# EAGLE design IR Cape (EAGLE 6.4)
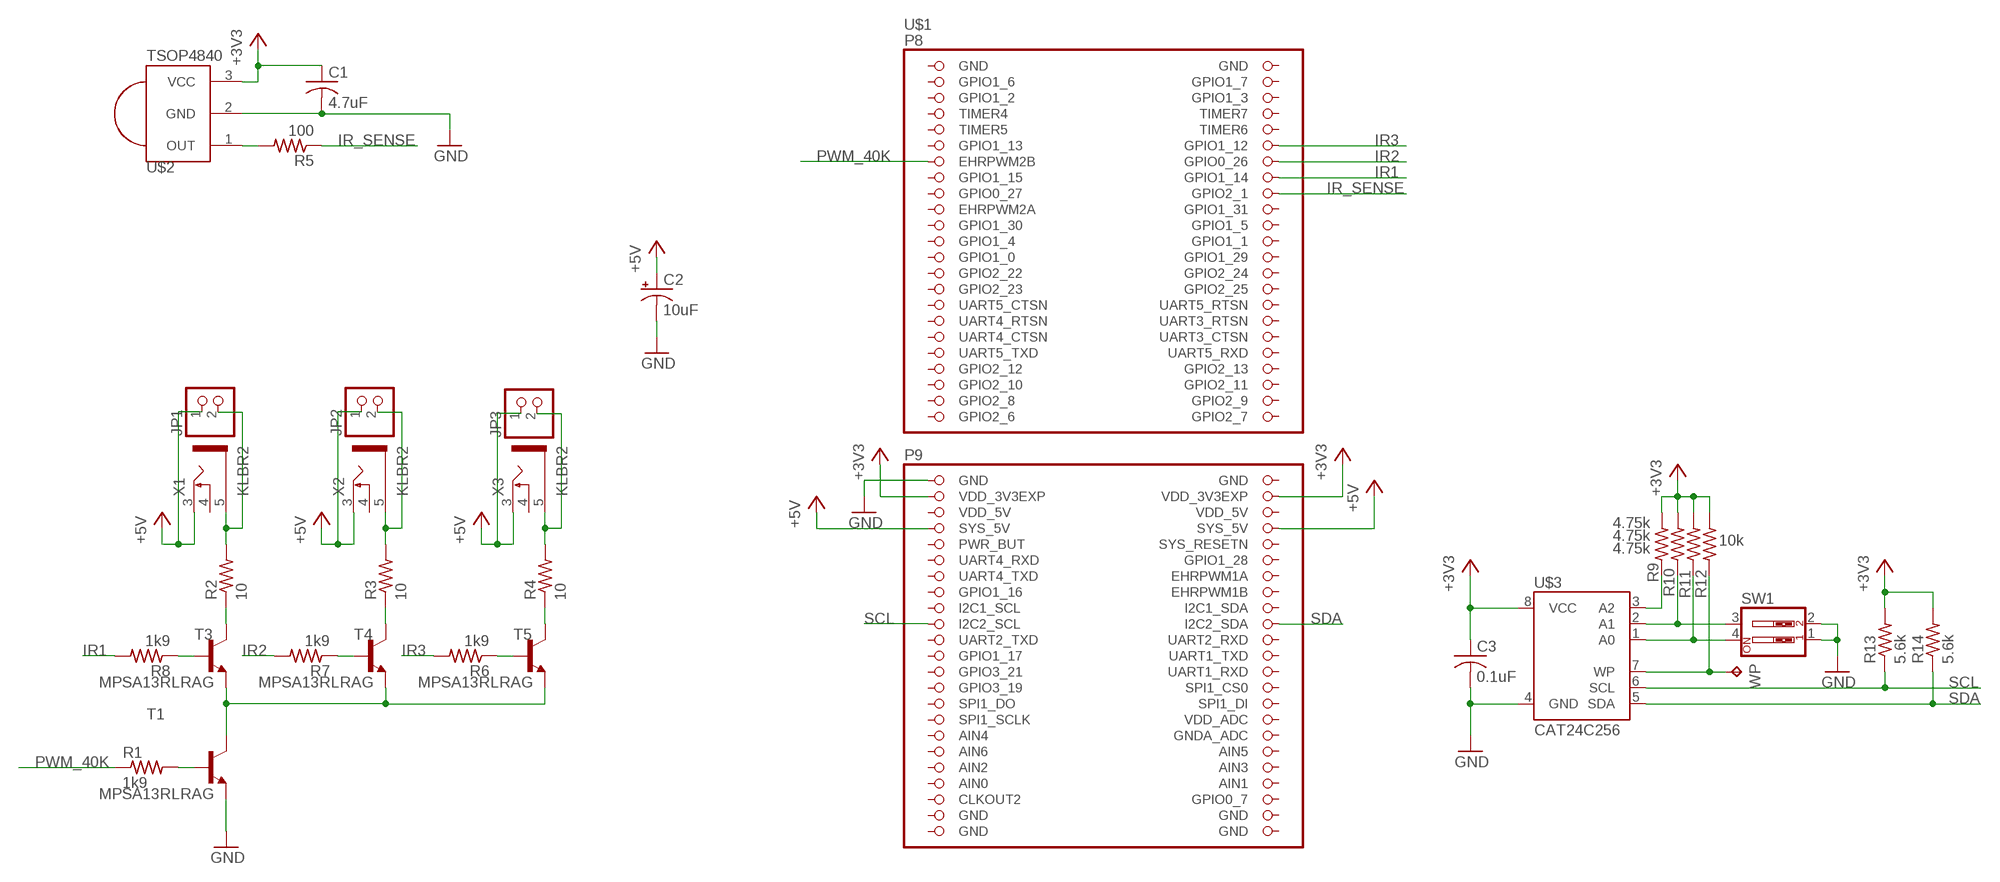
[diagram p0: schematic, sheet 1]

## Parts
C1  4.7uF  C-US025-024X044  [C025-024X044]
C2  10uF  CPOL-USE2-5  [E2-5]
C3  0.1uF  C-US025-024X044  [C025-024X044]
JP1  PINHD-1X2  [1X02]
JP2  PINHD-1X2  [1X02]
JP3  PINHD-1X2  [1X02]
R1  1k9  R-US_0207/10  [0207/10]
R2  10  R-US_0207/10  [0207/10]
R3  10  R-US_0207/10  [0207/10]
R4  10  R-US_0207/10  [0207/10]
R5  100  R-US_0207/10  [0207/10]
R6  1k9  R-US_0207/10  [0207/10]
R7  1k9  R-US_0207/10  [0207/10]
R8  1k9  R-US_0207/10  [0207/10]
R9  4.75k  R-US_0207/10  [0207/10]
R10  4.75k  R-US_0207/10  [0207/10]
R11  4.75k  R-US_0207/10  [0207/10]
R12  10k  R-US_0207/10  [0207/10]
R13  5.6k  R-US_0207/10  [0207/10]
R14  5.6k  R-US_0207/10  [0207/10]
SW1  SW_DIP-2  [EDG-02]
T1  MPSA13RLRAG  2N2222-NPN-TO92-EBC  [TO92-EBC]
T3  MPSA13RLRAG  2N2222-NPN-TO92-EBC  [TO92-EBC]
T4  MPSA13RLRAG  2N2222-NPN-TO92-EBC  [TO92-EBC]
T5  MPSA13RLRAG  2N2222-NPN-TO92-EBC  [TO92-EBC]
U$1  BEAGLEBONE_OUTLINE  [BEAGLEBONE_SHIELD]
U$2  TSOP4840  PNA460XM  [PNA460XM]
U$3  CAT24C256  [CAT24C256]
WP  TPB1,27  [B1,27]
X1  KLBR2  [KLBR2]
X2  KLBR2  [KLBR2]
X3  KLBR2  [KLBR2]

## Nets
+3V3: C1.1 C3.1 R9.2 R10.2 R11.2 R12.1 R13.2 R14.2 U$1.49(VDD_3V3EXP) U$1.50(VDD_3V3EXP) U$2.3(VCC) U$3.8(VCC)
+5V: C2.+ JP1.1 JP2.1 JP3.1 U$1.53(SYS_5V) U$1.54(SYS_5V) X1.3 X2.3 X3.3
GND: C1.2 C2.- C3.2 SW1.1 SW1.2 T1.E U$1.47(GND) U$2.2(GND) U$3.4(GND)
IR1: R8.2 U$1.16(GPIO1_14)
IR2: R7.2 U$1.14(GPIO0_26)
IR3: R6.2 U$1.12(GPIO1_12)
IR_SENSE: R5.1 U$1.18(GPIO2_1)
N$1: JP1.2 R2.2 X1.5
N$2: T1.C T3.E T4.E T5.E
N$3: R1.2 T1.B
N$4: R4.1 T5.C
N$5: JP3.2 R4.2 X3.5
N$6: R3.1 T4.C
N$7: R2.1 T3.C
N$9: JP2.2 R3.2 X2.5
N$10: R5.2 U$2.1(OUT)
N$11: R11.1 SW1.4 U$3.1(A0)
N$12: R8.1 T3.B
N$13: R7.1 T4.B
N$14: R6.1 T5.B
N$15: R10.1 SW1.3 U$3.2(A1)
N$16: R12.2 U$3.7(WP) WP.TP
N$17: R9.1 U$3.3(A2)
PWM_40K: R1.1 U$1.13(EHRPWM2B)
SCL: R13.1 U$1.65(I2C2_SCL) U$3.6(SCL)
SDA: R14.1 U$1.66(I2C2_SDA) U$3.5(SDA)
Unconnected: U$1.3(GPIO1_6) U$1.4(GPIO1_7) U$1.5(GPIO1_2) U$1.6(GPIO1_3) U$1.7(TIMER4) U$1.8(TIMER7) U$1.9(TIMER5) U$1.10(TIMER6) U$1.11(GPIO1_13) U$1.15(GPIO1_15) U$1.17(GPIO0_27) U$1.19(EHRPWM2A) U$1.20(GPIO1_31) U$1.21(GPIO1_30) U$1.22(GPIO1_5) U$1.23(GPIO1_4) U$1.24(GPIO1_1) U$1.25(GPIO1_0) U$1.26(GPIO1_29) U$1.27(GPIO2_22) U$1.28(GPIO2_24) U$1.29(GPIO2_23) U$1.30(GPIO2_25) U$1.31(UART5_CTSN) U$1.32(UART5_RTSN) U$1.33(UART4_RTSN) U$1.34(UART3_RTSN) U$1.35(UART4_CTSN) U$1.36(UART3_CTSN) U$1.37(UART5_TXD) U$1.38(UART5_RXD) U$1.39(GPIO2_12) U$1.40(GPIO2_13) U$1.41(GPIO2_10) U$1.42(GPIO2_11) U$1.43(GPIO2_8) U$1.44(GPIO2_9) U$1.45(GPIO2_6) U$1.46(GPIO2_7) U$1.55(PWR_BUT) U$1.56(SYS_RESETN) U$1.57(UART4_RXD) U$1.58(GPIO1_28) U$1.59(UART4_TXD) U$1.60(EHRPWM1A) U$1.61(GPIO1_16) U$1.62(EHRPWM1B) U$1.63(I2C1_SCL) U$1.64(I2C1_SDA) U$1.67(UART2_TXD) U$1.68(UART2_RXD) U$1.69(GPIO1_17) U$1.70(UART1_TXD) U$1.71(GPIO3_21) U$1.72(UART1_RXD) U$1.73(GPIO3_19) U$1.74(SPI1_CS0) U$1.75(SPI1_DO) U$1.76(SPI1_DI) U$1.77(SPI1_SCLK) U$1.78(VDD_ADC) U$1.79(AIN4) U$1.80(GNDA_ADC) U$1.81(AIN6) U$1.82(AIN5) U$1.83(AIN2) U$1.84(AIN3) U$1.86(AIN1) U$1.87(CLKOUT2) U$1.88(GPIO0_7) X1.4 X2.4 X3.4

## Power pins joined to a net without a drawn wire
AIN0: U$1.85(AIN0)
GND: U$1.1(GND) U$1.2(GND) U$1.48(GND) U$1.89(GND) U$1.90(GND) U$1.91(GND) U$1.92(GND)
VDD_5V: U$1.51(VDD_5V) U$1.52(VDD_5V)

## Library data of the parts
C1 C3 = rcl:C-US: CAPACITOR, American symbol
C2 = adafruit:CPOL-US: POLARIZED CAPACITOR, American symbol
JP1-JP3 = pinhead:PINHD-1X2: PIN HEADER
R1-R14 = resistor:R-US_: RESISTOR, American symbol
SW1 = special:SW_DIP-2: DIP SWITCH
T1 T3-T5 = transistor-neu-to92:*-NPN-: NPN Transistror
U$1 = adafruit:BEAGLEBONE_OUTLINE: Should match A3 pinout - but not completely tested
U$2 = adafruit:PNA460XM: IR 38KHz receiver PNA4602 and related receivers http://www.ladyada.net/library/pcb/eaglelibrary.html
U$3 = ON Semiconductor EEPROM:CAT24C256
WP = testpad:TP: Test pad
X1-X3 = con-lumberg:KLBR?: Jack connectors according to JISC 6560, 2.5mm / 3.5 mm Klinkensteckverbinder nach JISC 6560, 2.5mm / 3,5 mm Source: http://www.lumberg.com/Produkte/PDFs/KLBR2.pdf www.lumberg.com/Produkte/PDFs/KLBR1.pdf; OC_FARNELL: unknown; OC_NEWARK: unknown

## Board
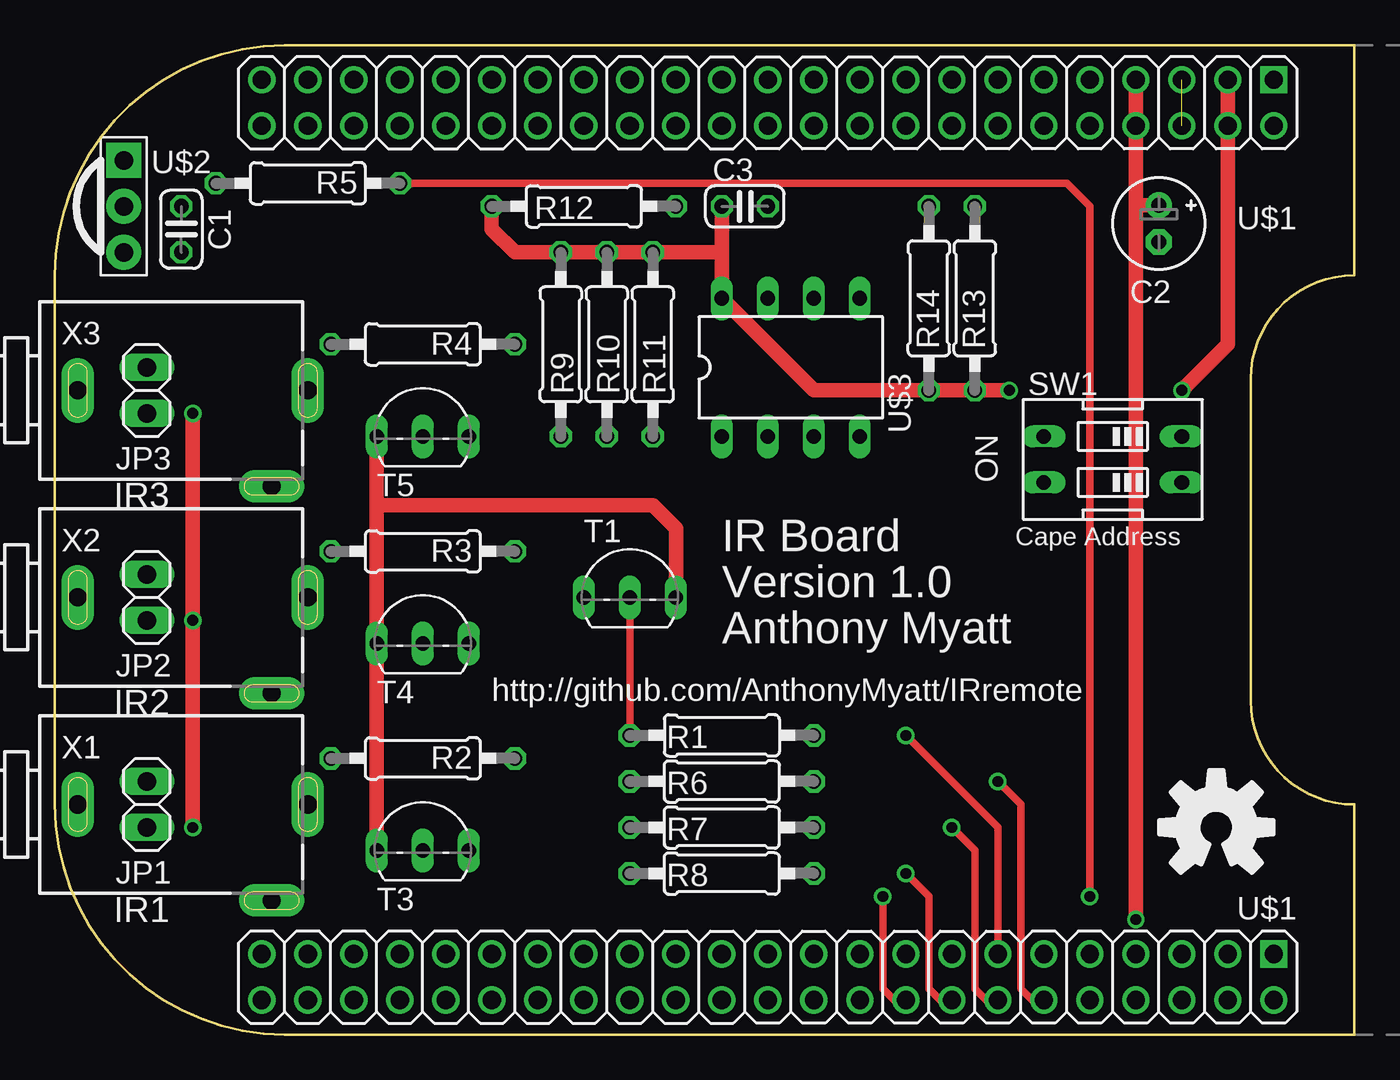
[diagram p1: board, top side]
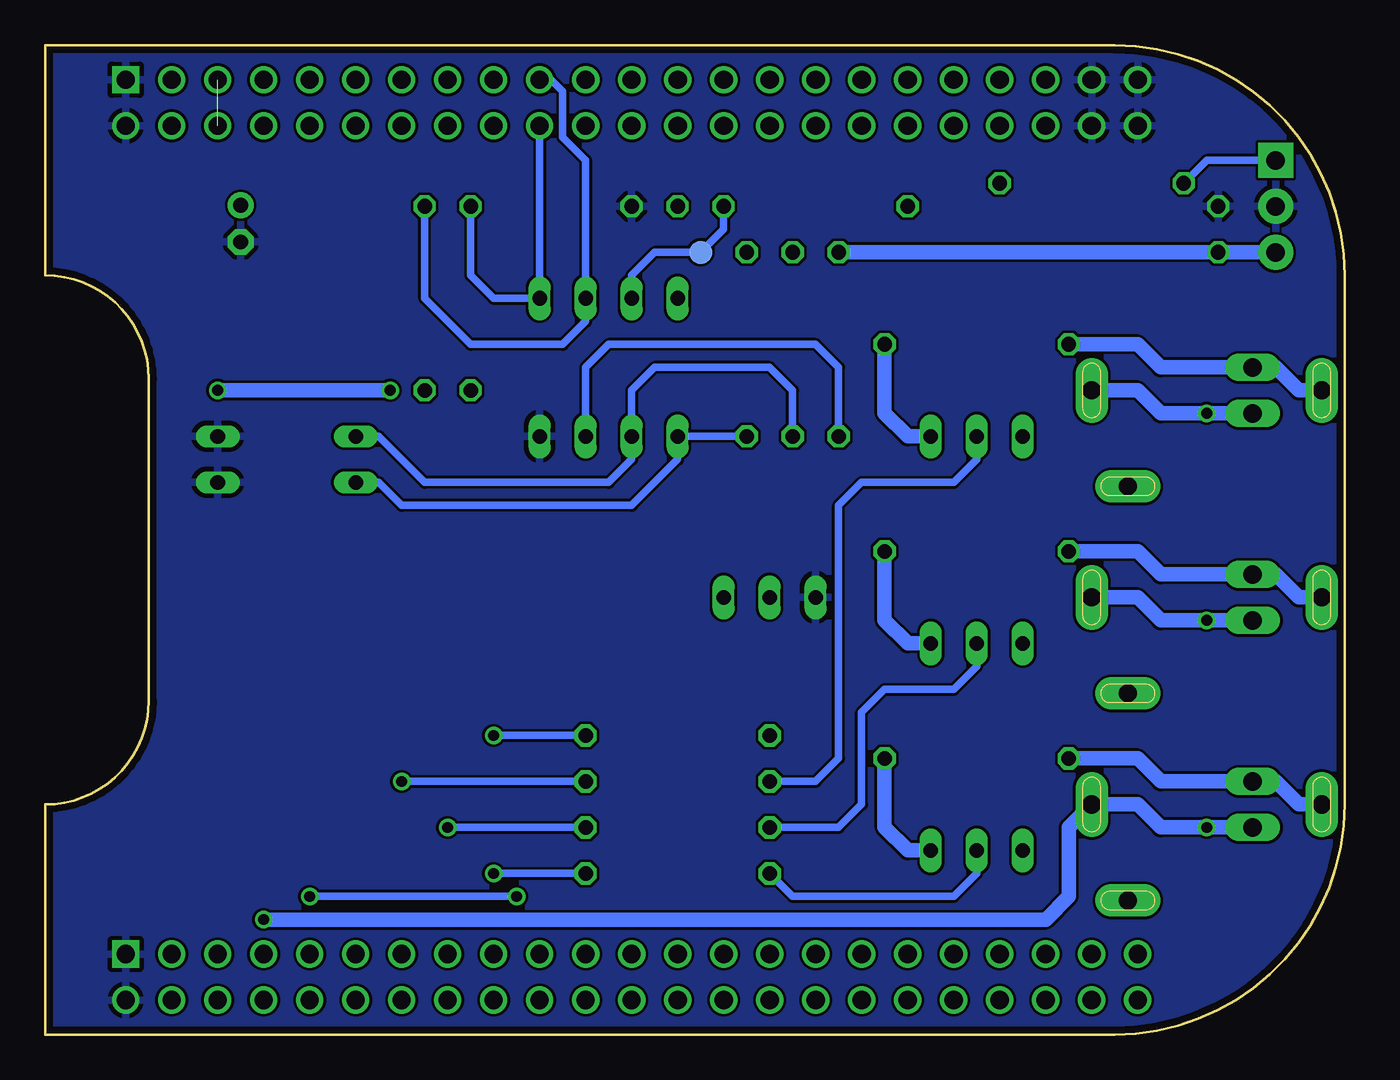
[diagram p2: board, bottom side, seen from below]

Size 71.75 x 54.61 mm. Coordinates in mm from the lower left corner, seen from the top.
Copper layers (1*16): Top 0.0356mm / dielectric 1.5011mm / Bottom 0.0356mm
Design rules "OSHPark *": minimum track width 6mil, minimum drill 13mil, track to track 6mil, track to pad 6mil, pad to pad 6mil, via to via 6mil, smd to smd 6mil, copper to edge 15mil, drill to drill 6mil, minimum pad ring 7mil, minimum via ring 7mil, stop-mask expansion 4mil, vias tented up to drill 200mil, thermal gap 10mil

### Footprints (pad centres in the part's own frame; a part is rotated, then mirrored left to right if it is on the bottom)
C025-024X044 = drill 0.813 octagon: 1 -1.27,0; 2 1.27,0
E2-5 = drill 0.813 pad 1.422: + -1.016,0 | drill 0.813 pad 1.422 octagon: - 1.016,0
1X02 = drill 1.016 long: 1 -1.27,0; 2 1.27,0
0207/10 = drill 0.813 octagon: 1 -5.08,0; 2 5.08,0
EDG-02 = drill 0.813 long: 1 -1.27,-3.81; 2 1.27,-3.81; 3 1.27,3.81; 4 -1.27,3.81
TO92-EBC = drill 0.813 long: B 0,-1.27; C 2.54,-1.27; E -2.54,-1.27
BEAGLEBONE_SHIELD = drill 1 square: 1 4.445,19.05; 47 52.705,19.05 | drill 1: 2 1.905,19.05; 3 4.445,21.59; 4 1.905,21.59; 5 4.445,24.13; 6 1.905,24.13; 7 4.445,26.67; 8 1.905,26.67; 9 4.445,29.21; 10 1.905,29.21; 11 4.445,31.75; 12 1.905,31.75; 13 4.445,34.29; 14 1.905,34.29; 15 4.445,36.83; 16 1.905,36.83; 17 4.445,39.37; 18 1.905,39.37; 19 4.445,41.91; 20 1.905,41.91; 21 4.445,44.45; 22 1.905,44.45; 23 4.445,46.99; 24 1.905,46.99; 25 4.445,49.53; 26 1.905,49.53; 27 4.445,52.07; 28 1.905,52.07; 29 4.445,54.61; 30 1.905,54.61; 31 4.445,57.15; 32 1.905,57.15; 33 4.445,59.69; 34 1.905,59.69; 35 4.445,62.23; 36 1.905,62.23; 37 4.445,64.77; 38 1.905,64.77; 39 4.445,67.31; 40 1.905,67.31; 41 4.445,69.85; 42 1.905,69.85; 43 4.445,72.39; 44 1.905,72.39; 45 4.445,74.93; 46 1.905,74.93; 48 50.165,19.05; 49 52.705,21.59; 50 50.165,21.59; 51 52.705,24.13; 52 50.165,24.13; 53 52.705,26.67; 54 50.165,26.67; 55 52.705,29.21; 56 50.165,29.21; 57 52.705,31.75; 58 50.165,31.75; 59 52.705,34.29; 60 50.165,34.29; 61 52.705,36.83; 62 50.165,36.83; 63 52.705,39.37; 64 50.165,39.37; 65 52.705,41.91; 66 50.165,41.91; 67 52.705,44.45; 68 50.165,44.45; 69 52.705,46.99; 70 50.165,46.99; 71 52.705,49.53; 72 50.165,49.53; 73 52.705,52.07; 74 50.165,52.07; 75 52.705,54.61; 76 50.165,54.61; 77 52.705,57.15; 78 50.165,57.15; 79 52.705,59.69; 80 50.165,59.69; 81 52.705,62.23; 82 50.165,62.23; 83 52.705,64.77; 84 50.165,64.77; 85 52.705,67.31; 86 50.165,67.31; 87 52.705,69.85; 88 50.165,69.85; 89 52.705,72.39; 90 50.165,72.39; 91 52.705,74.93; 92 50.165,74.93
PNA460XM = drill 1.016 pad 1.93 square: 1 -2.54,0 | drill 1.016 pad 1.93: 2 0,0; 3 2.54,0
CAT24C256 = drill 0.813 long: 1 -3.81,-3.81; 2 -1.27,-3.81; 3 1.27,-3.81; 4 3.81,-3.81; 5 3.81,3.81; 6 1.27,3.81; 7 -1.27,3.81; 8 -3.81,3.81
B1,27 = smd 1.27 x 1.27: TP 0,0
KLBR2 = drill 1 pad 1.8 long: 3 0,-6.35; 4 -5.3,-4.35; 5 0,6.35

### Placement (x,y rotation side)
C1  6.99,44.45 90 top
C2  60.96,44.77 270 top
C3  38.1,45.72 0 top
JP1  5.08,12.7 90 top
JP2  5.08,24.13 90 top
JP3  5.08,35.56 90 top
R1  36.83,16.51 180 top
R2  20.32,15.24 180 top
R3  20.32,26.67 180 top
R4  20.32,38.1 180 top
R5  13.97,46.99 180 top
R6  36.83,13.97 0 top
R7  36.83,11.43 0 top
R8  36.83,8.89 0 top
R9  27.94,38.1 90 top
R10  30.48,38.1 90 top
R11  33.02,38.1 90 top
R12  29.21,45.72 0 top
R13  50.8,40.64 270 top
R14  48.26,40.64 270 top
SW1  58.42,31.75 90 top
T1  31.75,25.4 0 top
T3  20.32,11.43 0 top
T4  20.32,22.86 0 top
T5  20.32,34.29 0 top
U$1  86.36,0 90 top
U$2  3.81,45.72 270 top
U$3  40.64,36.83 0 top
WP  35.56,43.18 0 bottom
X1  7.62,12.7 90 top
X2  7.62,24.13 90 top
X3  7.62,35.56 90 top

### Tracks (layer width: path | path; a pad name or v marks a point on that pad's centre or on a via)
+3V3  (via drill 0.6)
  Top 0.813: 36.83,43.18 U$3.8 41.91,35.56 R14.2 R13.2 v52.7,35.56 | 36.83,43.18 C3.1 | 36.83,43.18 R11.2 R10.2 R9.2 25.4,43.18 24.13,44.45 R12.1 | U$1.49 U$1.50 64.77,38.1 v62.23,35.56
  Bottom 0.813: U$2.3 C1.1 R9.2 | v62.23,35.56 v52.7,35.56
+5V  (via drill 0.6)
  Top 0.61: U$1.54 59.69,45.78
  Top 0.813: U$1.53 U$1.54 v59.69,6.35 | v7.62,11.43 v7.62,22.86 v7.62,34.29 | 59.69,45.78 C2.+
  Bottom 0.813: JP1.1 v7.62,11.43 10.16,11.43 11.43,12.7 X1.3 15.24,11.43 15.24,7.62 16.51,6.35 v59.69,6.35 | JP2.1 v7.62,22.86 10.16,22.86 11.43,24.13 X2.3 | JP3.1 v7.62,34.29 10.16,34.29 11.43,35.56 X3.3
GND
  pour Bottom: 73.66,55.88 -1.27,55.88 -1.27,-1.27 73.66,-1.27
IR1  (via drill 0.6)
  Top 0.406: U$1.16 48.9,1.91 48.26,2.54 48.26,7.62 v46.99,8.89
  Bottom 0.406: v46.99,8.89 R8.2
IR2  (via drill 0.6)
  Top 0.406: U$1.14 51.44,1.91 50.8,2.54 50.8,10.16 v49.53,11.43
  Bottom 0.406: v49.53,11.43 R7.2
IR3  (via drill 0.6)
  Top 0.406: U$1.12 53.98,1.91 53.34,2.54 53.34,12.7 v52.07,13.97
  Bottom 0.406: v52.07,13.97 R6.2
IR_SENSE  (via drill 0.6)
  Top 0.406: U$1.18 46.35,1.91 45.72,2.54 v45.72,7.62 | v57.15,7.62 57.15,45.72 55.88,46.99 R5.1
  Bottom 0.406: v45.72,7.62 v57.15,7.62
N$1
  Bottom 0.813: X1.5 2.54,12.7 3.81,13.97 JP1.2 10.16,13.97 11.43,15.24 R2.2
N$2
  Top 0.813: T5.E 17.78,29.21 | 17.78,29.21 T4.E T3.E | T1.C 34.29,27.94 33.02,29.21 17.78,29.21
N$3
  Top 0.406: R1.2 T1.B
N$4
  Bottom 0.813: T5.C 24.13,33.02 25.4,34.29 R4.1
N$5
  Bottom 0.61: 3.81,36.83 JP3.2
  Bottom 0.813: X3.5 2.54,35.56 3.81,36.83 | JP3.2 10.16,36.83 11.43,38.1 R4.2
N$6
  Bottom 0.813: T4.C 24.13,21.59 25.4,22.86 R3.1
N$7
  Bottom 0.813: T3.C 24.13,10.16 25.4,11.43 R2.1
N$8
  Top 0.254: 64.97,9.41 arc10 65.29,9.58 66.09,8.93 66.64,9.47 65.99,10.27 arc19 66.26,10.94 67.29,11.04 67.29,11.82 66.26,11.92 arc19 65.99,12.59 66.64,13.38 66.09,13.93 65.29,13.28 arc19 64.63,13.56 64.52,14.58 63.75,14.58 63.64,13.56 arc19 62.98,13.28 62.18,13.93 61.63,13.38 62.28,12.59 arc19 62.01,11.92 60.98,11.82 60.98,11.04 62.01,10.94 arc19 62.28,10.27 61.63,9.47 62.18,8.93 62.98,9.58 arc10 63.3,9.41 63.76,10.51 arc-68 63.14,11.43 arc-248 64.52,10.51 64.97,9.41
N$9
  Bottom 0.813: X2.5 2.54,24.13 3.81,25.4 JP2.2 10.16,25.4 11.43,26.67 R3.2
N$10
  Bottom 0.406: U$2.1 7.62,48.26 R5.2
N$11
  Bottom 0.406: R11.1 U$3.1 36.83,31.75 39.37,29.21 52.07,29.21 53.34,30.48 SW1.4
N$12
  Bottom 0.406: R8.1 30.48,7.62 21.59,7.62 20.32,8.89 T3.B
N$13
  Bottom 0.406: R7.1 27.94,11.43 26.67,12.7 26.67,17.78 25.4,19.05 21.59,19.05 20.32,20.32 T4.B
N$14
  Bottom 0.406: R6.1 29.21,13.97 27.94,15.24 27.94,29.21 26.67,30.48 21.59,30.48 20.32,31.75 T5.B
N$15
  Bottom 0.406: R10.1 30.48,35.56 31.75,36.83 38.1,36.83 39.37,35.56 U$3.2 39.37,31.75 40.64,30.48 50.8,30.48 53.34,33.02 SW1.3
N$16
  Bottom 0.406: U$3.7 39.37,41.91 38.1,43.18 WP.TP 34.29,44.45 R12.2
N$17
  Bottom 0.406: R9.1 27.94,36.83 29.21,38.1 40.64,38.1 41.91,36.83 U$3.3
PWM_40K  (via drill 0.6)
  Top 0.406: U$1.13 52.07,11.43 v46.99,16.51
  Bottom 0.406: v46.99,16.51 R1.1
SCL
  Bottom 0.406: R13.1 50.8,40.64 48.26,38.1 43.18,38.1 41.91,39.37 U$3.6 41.91,48.26 43.18,49.53 43.18,52.07 43.81,52.7 U$1.65
SDA
  Bottom 0.406: R14.1 48.26,41.91 46.99,40.64 U$3.5 U$1.66
VDD_5V  (1 unrouted)

### Text on the board
tNames: IR3 | ON | IR Board | Cape Address | Version 1.0 | Anthony Myatt | IR2 | http://github.com/AnthonyMyatt/IRremote | IR1